# Altium schematic sheet Архитектура.SchDoc
size A3; DocumentNumber: 1; SheetNumber: 1; SheetTotal: 12
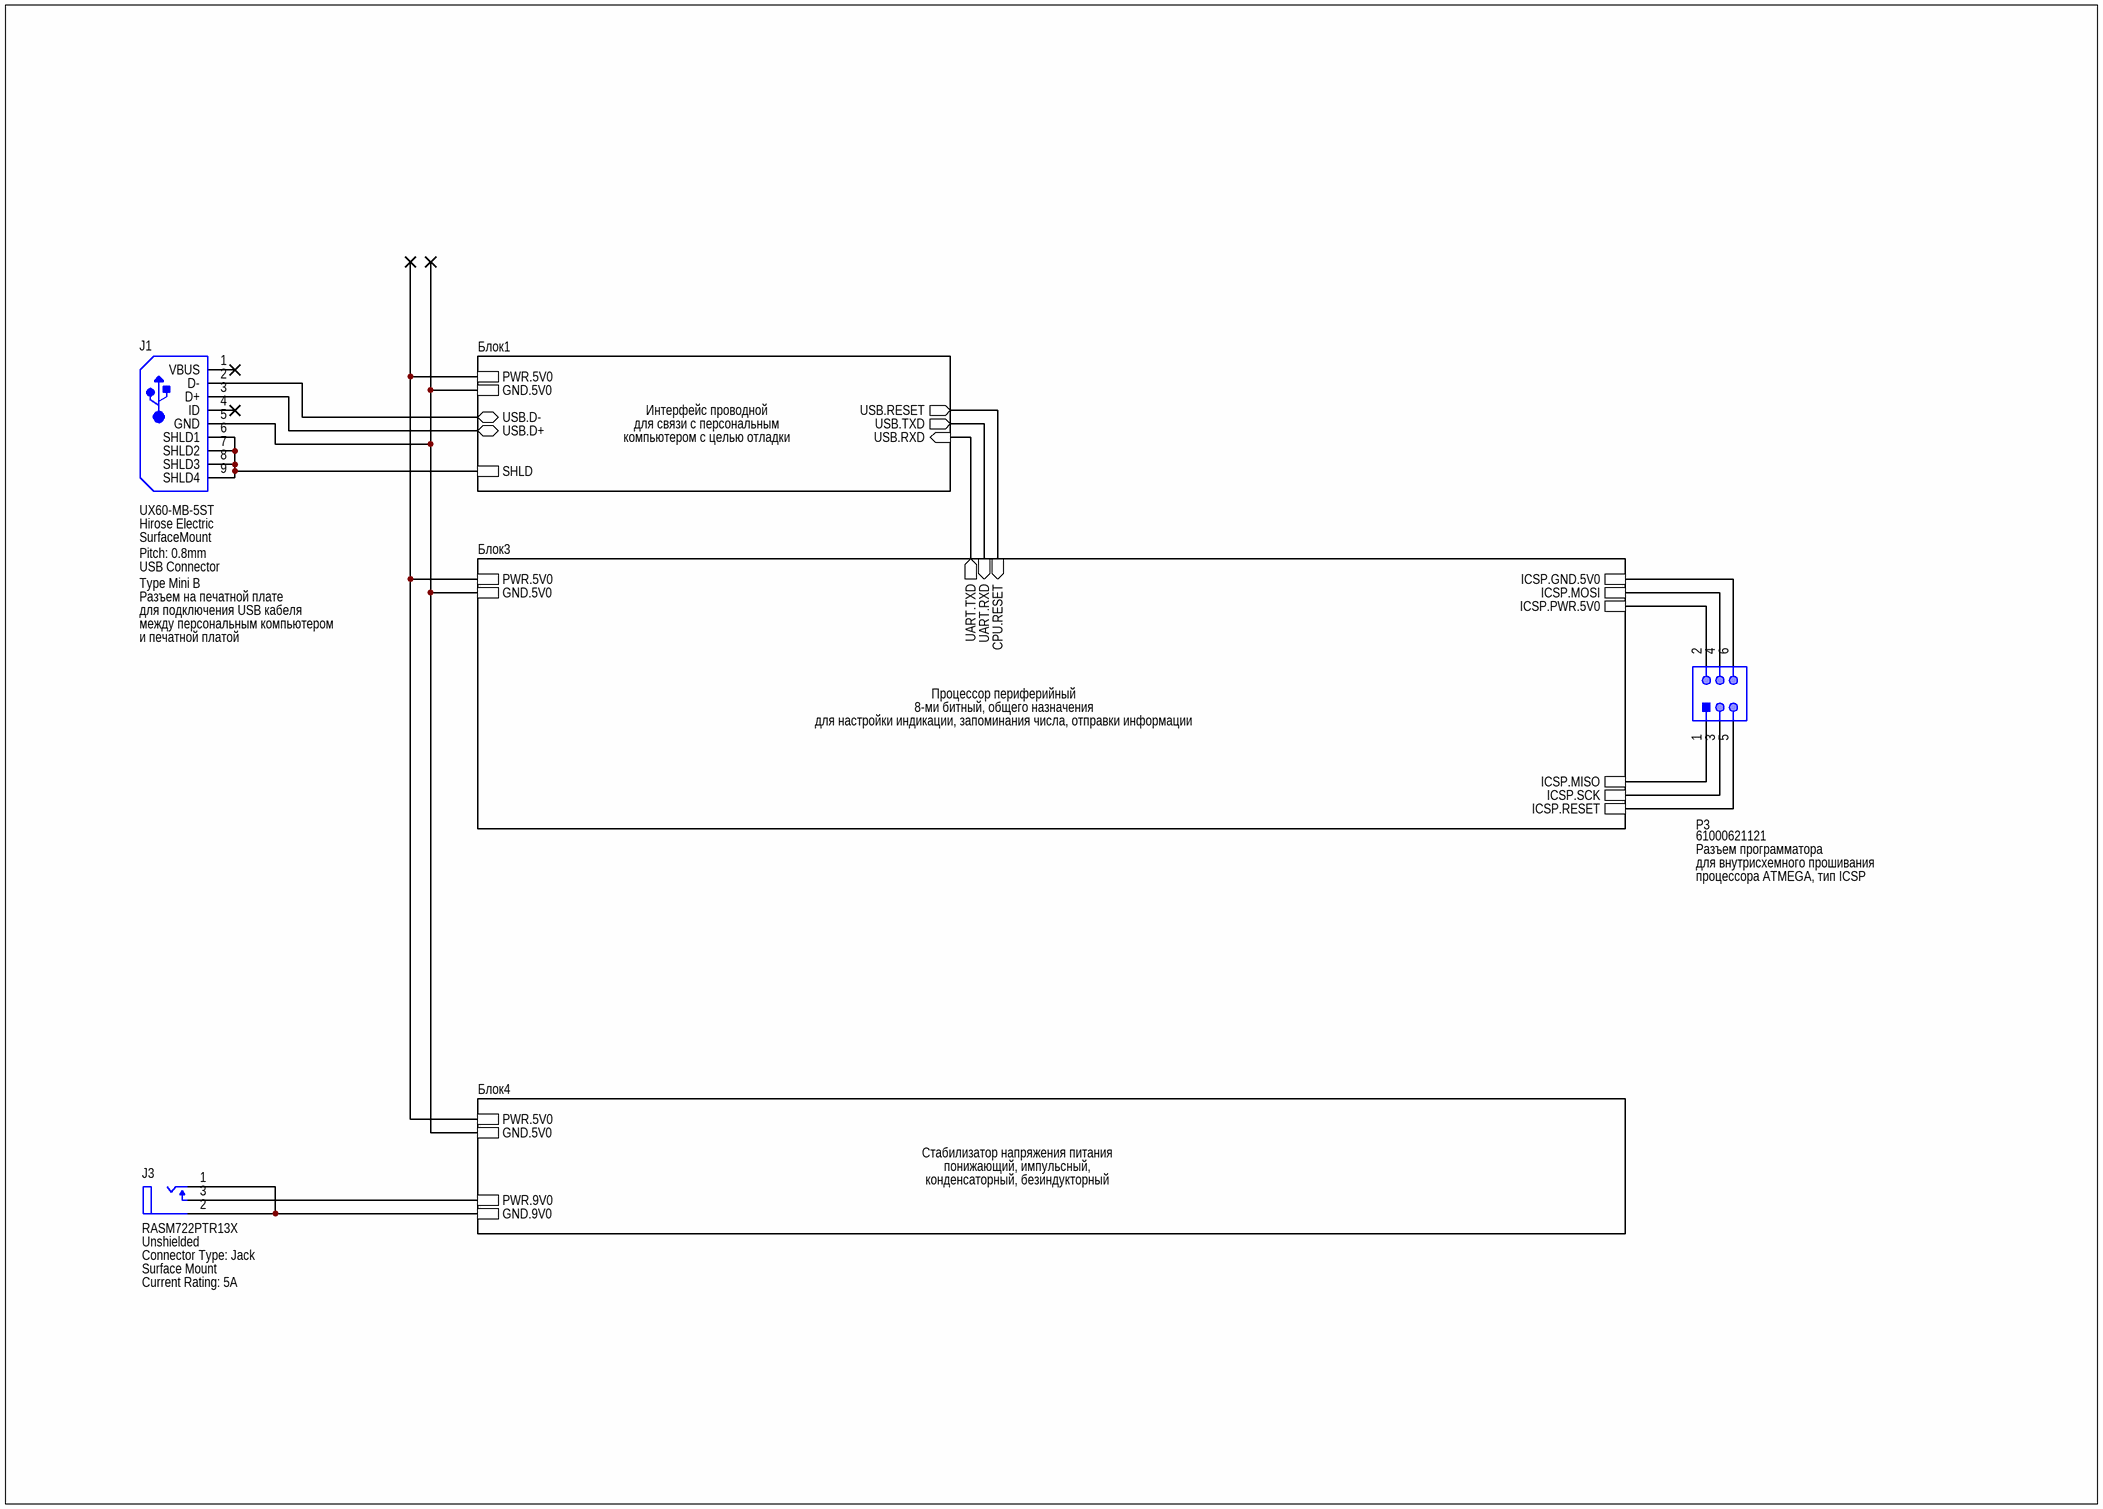
[diagram p0: Архитектура.SchDoc]

## Parts
J1  UX60-MB-5ST  Manufacturer: Hirose Electric  Termination: SurfaceMount  Pitch: 0.8mm  Parameter 1: USB Connector  Parameter 2: Type Mini B  Parameter 3: Разъем на печатной плате  Parameter 4: для подключения USB кабеля  Parameter 5: между персональным компьютером  Parameter 6: и печатной платой  [HIRO-UX60-MB-5ST_V]
J3  RASM722PTR13X  Shielding: Unshielded  Connector Type: Jack  Mount: Surface Mount  Current Rating: 5A  [FP-RASM722PTR13X-MFG]
P3  61000621121  Parameter 1: Разъем программатора  Parameter 2: для внутрисхемного прошивания  Parameter 3: процессора ATMEGA, тип ICSP  [61000621121]

## Sub-sheets
Блок1 = Блок1.SchDoc: USB.RXD (in), USB.TXD (out), USB.RESET (out), GND.5V0, PWR.5V0, USB.D- (bidir), USB.D+ (bidir), SHLD  | Parameter 1: Интерфейс проводной; Parameter 2: для связи с персональным; Parameter 3: компьютером с целью отладки
Блок3 = Блок3.SchDoc: UART.TXD (out), UART.RXD (in), CPU.RESET (in), PWR.5V0, GND.5V0, ICSP.MISO, ICSP.SCK, ICSP.RESET, ICSP.PWR.5V0, ICSP.MOSI, ICSP.GND.5V0  | Parameter 1: Процессор периферийный; Parameter 2: 8-ми битный, общего назначения; Parameter 3: для настройки индикации, запоминания числа, отправки информации
Блок4 = Блок4.SchDoc: GND.9V0, PWR.5V0, PWR.9V0, GND.5V0  | Parameter 1: Стабилизатор напряжения питания; Parameter 2: понижающий, импульсный,; Parameter 3: конденсаторный, безиндукторный

## Nets
NetJ1_2: J1.2(D-) ; sheet Блок1/USB.D-
NetJ1_3: J1.3(D+) ; sheet Блок1/USB.D+
NetJ1_5: J1.5(GND) ; sheet Блок3/GND.5V0, sheet Блок4/GND.5V0, sheet Блок1/GND.5V0
NetJ1_6: J1.6(SHLD1) J1.7(SHLD2) J1.8(SHLD3) J1.9(SHLD4) ; sheet Блок1/SHLD
NetJ3_1: J3.1(TIP_TERMINAL(CENTER_PIN)) J3.2(SLEEVE_TERMINAL) ; sheet Блок4/GND.9V0
NetJ3_3: J3.3(SHUNT_TERMINAL) ; sheet Блок4/PWR.9V0
NetP3_1: P3.1 ; sheet Блок3/ICSP.MISO
NetP3_2: P3.2 ; sheet Блок3/ICSP.PWR.5V0
NetP3_3: P3.3 ; sheet Блок3/ICSP.SCK
NetP3_4: P3.4 ; sheet Блок3/ICSP.MOSI
NetP3_5: P3.5 ; sheet Блок3/ICSP.RESET
NetP3_6: P3.6 ; sheet Блок3/ICSP.GND.5V0
(unnamed): sheet Блок3/UART.TXD, sheet Блок1/USB.RXD
(unnamed): sheet Блок3/UART.RXD, sheet Блок1/USB.TXD
(unnamed): sheet Блок3/CPU.RESET, sheet Блок1/USB.RESET
(unnamed): sheet Блок3/PWR.5V0, sheet Блок4/PWR.5V0, sheet Блок1/PWR.5V0

Not connected (* = marked no-connect by the designer): J1 1(VBUS)* 4(ID)*

## Library data of the parts
J1 = CMP-2000-07375-1: USB Connector Mini B Type, 1 A, 5 V AC, -30 to 75 degC, 5-Pin SMD, RoHS, Tape and Reel; No of Positions: 5; Style/Orientation: RightAngleSocket/Receptacle; Datasheet Version: 04/2008; Datasheet URL: http://datasheet.octopart.com/UX60-MB-5ST-Hirose-datasheet-8329595.pdf; Type: WiretoBoard; Package Reference: UX60-MB-5ST; Manufacturer URL: https://www.hirose.com; Mounting Technology: SurfaceMount; Package Description: 5-Pin Surface Mount Device, Body 7.7 x 9 mm, Pitch 0.8 mm
J3 = CMP-47995-000002-1: CONN PWR JACK 2.1X5.5MM SOLDER; Gender: Male; Termination: Solder; Contact Material: Copper Alloy; Package Quantity: 120; Case/Package: SMD/SMT; Contact Plating: Tin; Housing Material: Thermoplastic; Housing Color: Black; Color: Black
P3 = CMP-1502-01024-1: SMT Vertical Pin Header WR-PHD, Pitch 2.54 mm, Dual Row, 6 pins; Manufacturer: Wurth Elektronik; Withstanding Voltage: 500VAC; Contact Resistance: 20mOhm; Working Voltage: 250VAC; Gender: Male; Rated Current: 3A; Pin Number: 6; Pitch: 2.54mm; Part Number: 61000621121; Operating Temperature: -40to125degC; Mounting Technology: SMT; Packaging: Tube; Datasheet URL: https://katalog.we-online.de/em/datasheet/6100xx21121.pdf; Package Reference: 61000621121; Publisher: WurthElektronik; Row Number: Dual; Orientation: Vertical; Manufacturer URL: http://www.we-online.de